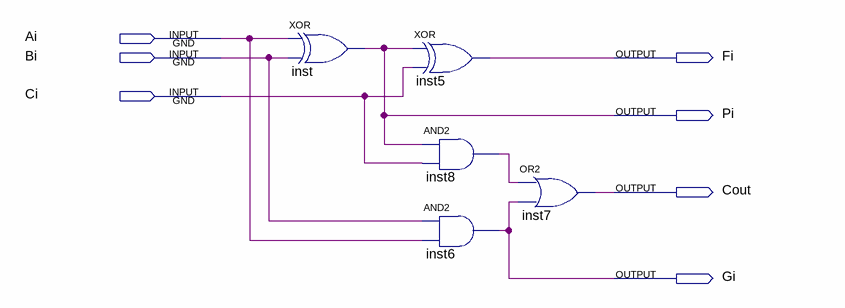
[diagram p0: schematic sheet]
// Quartus schematic add1.bdf as structural Verilog: 5 symbols, 7 pins
module add1 (
  input  Ai,
  input  Bi,
  input  Ci,
  output Fi,
  output Pi,
  output Cout,
  output Gi
);

  wire inst8_out;

  xor inst (Pi, Ai, Bi);
  xor inst5 (Fi, Pi, Ci);
  and inst8 (inst8_out, Pi, Ci);
  and inst6 (Gi, Bi, Ai);
  or inst7 (Cout, inst8_out, Gi);
endmodule
